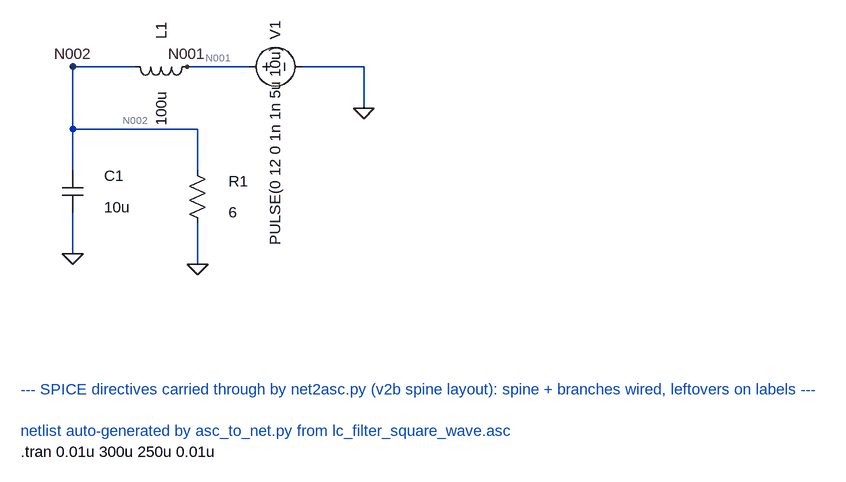
[diagram p0: schematic lc_filter_square_wave.asc]
lc_filter_square_wave.asc, the LTspice schematic file:
Version 4
SHEET 1 2080 928
WIRE 144 144 240 144
WIRE 320 144 416 144
WIRE 496 144 592 144
WIRE 592 144 592 208
WIRE 144 144 144 240
WIRE 144 240 144 304
WIRE 144 368 144 432
WIRE 144 144 144 240
WIRE 144 240 336 240
WIRE 336 240 336 304
WIRE 336 384 336 448
FLAG 144 144 N002
FLAG 592 208 0
FLAG 144 432 0
FLAG 336 448 0
FLAG 320 144 N001
SYMBOL ind 336 128 R90
WINDOW 0 -40 56 Center 2
WINDOW 3 80 56 Center 2
SYMATTR InstName L1
SYMATTR Value 100u
SYMBOL voltage 400 144 R270
WINDOW 0 56 56 Center 2
WINDOW 3 -120 56 Center 2
SYMATTR InstName V1
SYMATTR Value PULSE(0 12 0 1n 1n 5u 10u)
SYMBOL cap 128 304 R0
WINDOW 0 64 8 Left 2
WINDOW 3 64 56 Left 2
SYMATTR InstName C1
SYMATTR Value 10u
SYMBOL res 320 288 R0
WINDOW 0 64 32 Left 2
WINDOW 3 64 80 Left 2
SYMATTR InstName R1
SYMATTR Value 6
TEXT 64 640 Left 2 ;--- SPICE directives carried through by net2asc.py (v2b spine layout): spine + branches wired, leftovers on labels ---
TEXT 64 704 Left 2 ;netlist auto-generated by asc_to_net.py from lc_filter_square_wave.asc
TEXT 64 736 Left 2 !.tran 0.01u 300u 250u 0.01u

The netlist it stands for:
* lc_filter_square_wave.asc
L1 N001 N002 100u
V1 N001 0 PULSE(0 12 0 1n 1n 5u 10u)
C1 N002 0 10u
R1 N002 0 6
* --- SPICE directives carried through by net2asc.py (v2b spine layout): spine + branches wired, leftovers on labels ---
* netlist auto-generated by asc_to_net.py from lc_filter_square_wave.asc
.tran 0.01u 300u 250u 0.01u
.backanno
.end

* Results of the author's LTspice run, read from the files saved beside the schematic
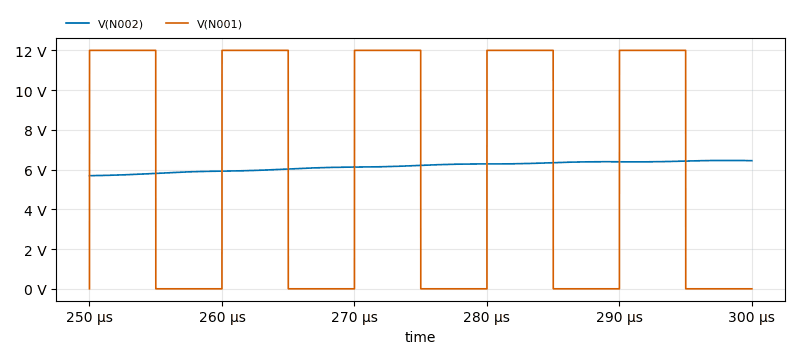
[diagram p1: Transient Analysis of lc_filter_square_wave.asc, plotted from the saved traces]
* Transient Analysis, 1 run:
*   V(N002): min 5.693 V, max 6.46 V, average 6.163 V, rms 6.167 V, last 6.449 V
*   V(N001): min 0 V, max 12 V, average 6.001 V, rms 8.486 V, last 0 V